# EAGLE design LB_BIT_1IN_3OUT-XL-v03(1_1x) (EAGLE 6.5.0)
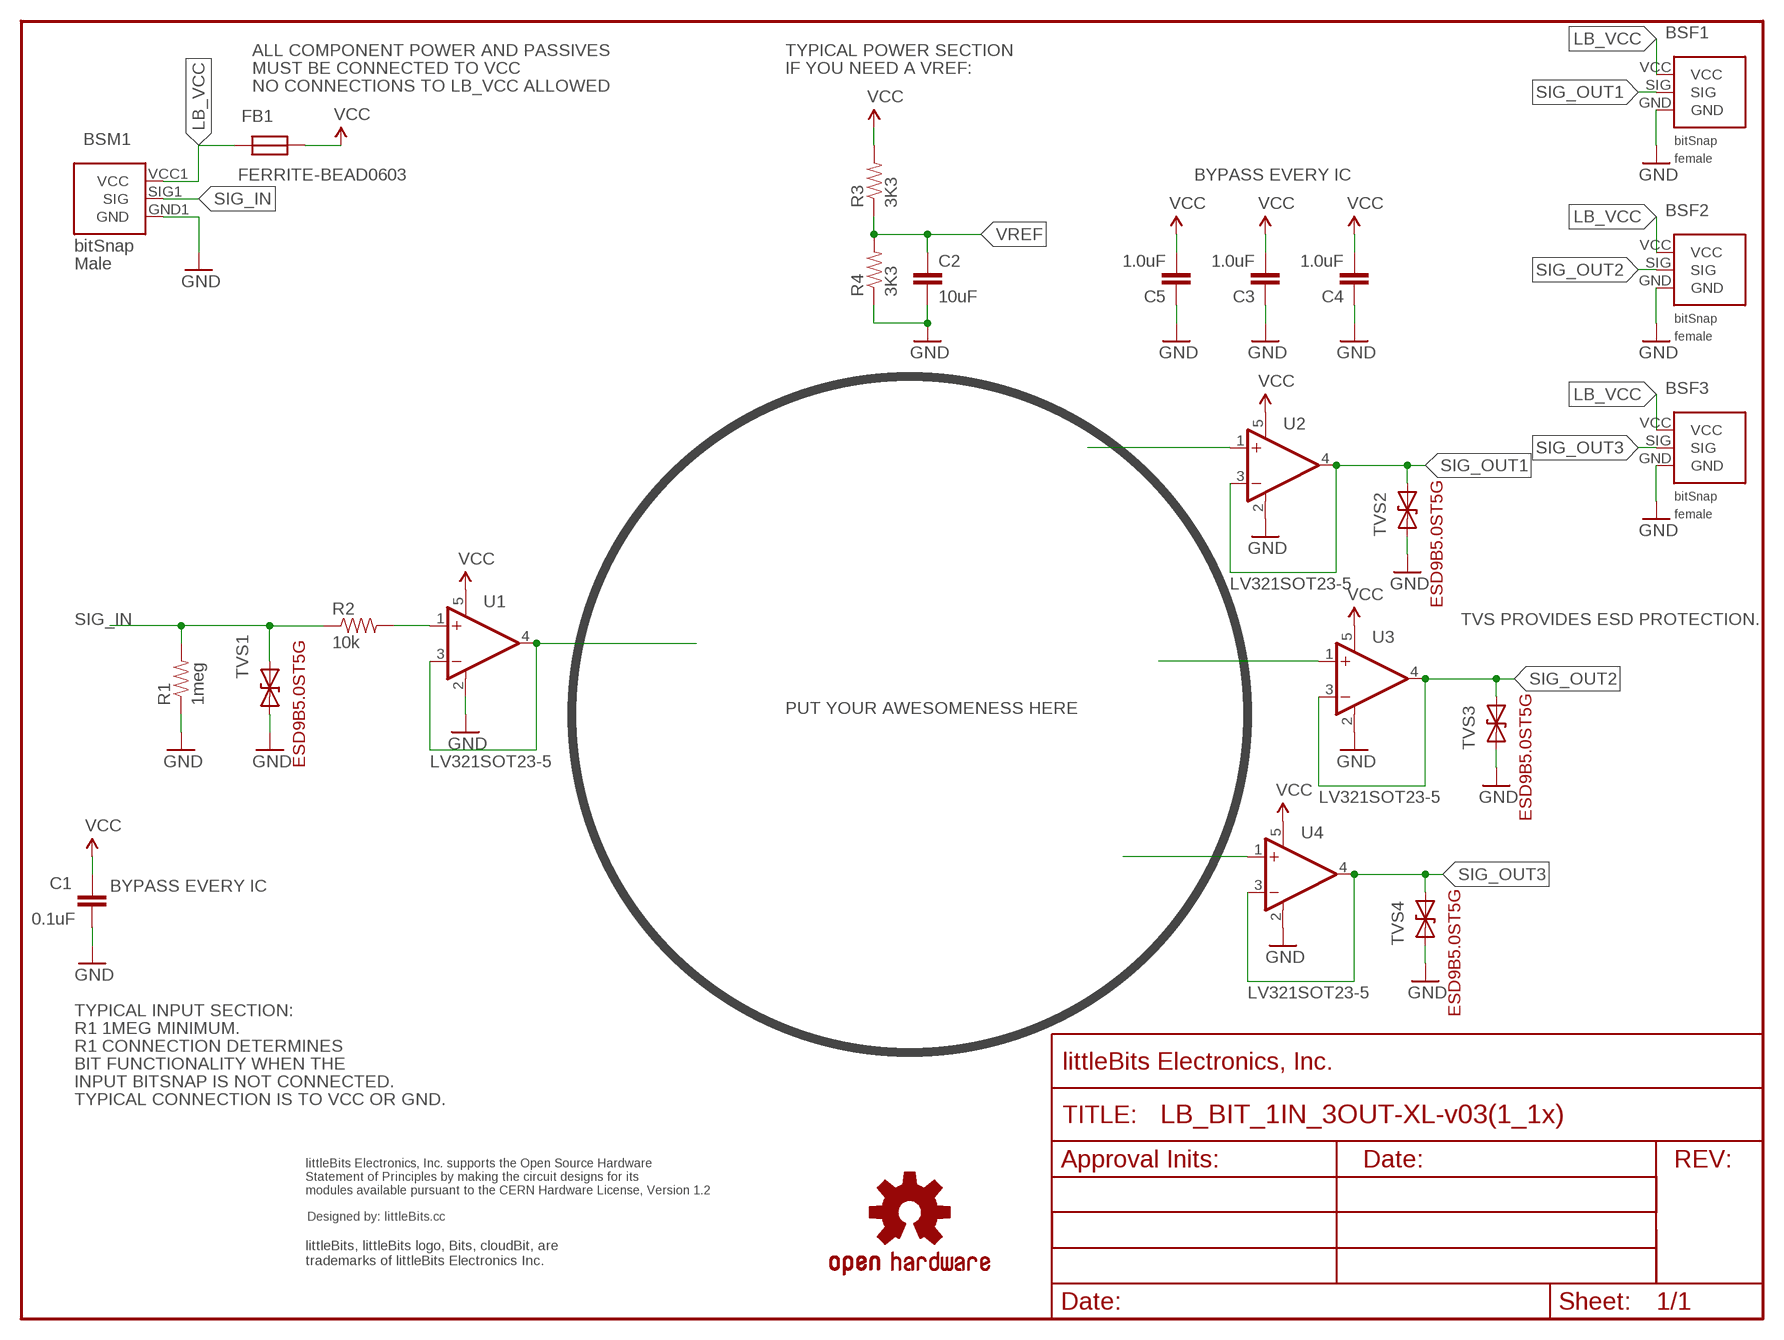
[diagram p0: schematic, sheet 1]

## Parts
BSF1  BITSNAP_V03_FEMALE  [BITSNAP_V03_FEMALE]
BSF2  BITSNAP_V03_FEMALE  [BITSNAP_V03_FEMALE]
BSF3  BITSNAP_V03_FEMALE  [BITSNAP_V03_FEMALE]
BSM1  BITSNAP_V03_MALE  [BITSNAP_V03_MALE]
C1  0.1uF  CAPCAP-0603  [CAP-0603]
C2  10uF  CAPCAP-0603  [CAP-0603]
C3  1.0uF  CAPCAP-0603  [CAP-0603]
C4  1.0uF  CAPCAP-0603  [CAP-0603]
C5  1.0uF  CAPCAP-0603  [CAP-0603]
FB1  FERRITE-BEAD0603  [R0603]
FRAME1  FRAME-LETTER  [FABDWG01-OHW]
R1  1meg  RESISTOR0603  [RES-0603]
R2  10k  RESISTOR0603  [RES-0603]
R3  3K3  RESISTOR0603  [RES-0603]
R4  3K3  RESISTOR0603  [RES-0603]
TVS1  DIODE-TVSSOD-923  [SOD-923]
TVS2  DIODE-TVSSOD-923  [SOD-923]
TVS3  DIODE-TVSSOD-923  [SOD-923]
TVS4  DIODE-TVSSOD-923  [SOD-923]
U1  LV321SOT23-5  [SOT23-5]
U2  LV321SOT23-5  [SOT23-5]
U3  LV321SOT23-5  [SOT23-5]
U4  LV321SOT23-5  [SOT23-5]
U$1  OSHWCREDIT  [OSHWCREDIT]
U$6  OSHW-LOGOL  [OSHW-LOGO-L]

## Nets
GND: BSF1.GND BSF2.GND BSF3.GND BSM1.GND1(GND) C1.2 C2.2 C3.1 C4.1 C5.1 R1.1 R4.1 TVS1.1(A) TVS2.1(A) TVS3.1(A) TVS4.1(A) U1.2(V-) U2.2(V-) U3.2(V-) U4.2(V-)
LB_VCC: BSF1.VCC BSF2.VCC BSF3.VCC BSM1.VCC1(VCC) FB1.2
N$1: U3.1(+IN)
N$2: U1.3(-IN) U1.4(OUT)
N$3: R2.2 U1.1(+IN)
N$4: U2.1(+IN)
N$5: U4.1(+IN)
SIG_IN: BSM1.SIG1(SIG) R1.2 R2.1 TVS1.2(C)
SIG_OUT1: BSF1.SIG TVS2.2(C) U2.3(-IN) U2.4(OUT)
SIG_OUT2: BSF2.SIG TVS3.2(C) U3.3(-IN) U3.4(OUT)
SIG_OUT3: BSF3.SIG TVS4.2(C) U4.3(-IN) U4.4(OUT)
VCC: C1.1 C3.2 C4.2 C5.2 FB1.1 R3.2 U1.5(V+) U2.5(V+) U3.5(V+) U4.5(V+)
VREF: C2.1 R3.1 R4.2

## Notes on the sheet
- ALL COMPONENT POWER AND PASSIVES | TYPICAL POWER SECTION
- MUST BE CONNECTED TO VCC | IF YOU NEED A VREF:
- NO CONNECTIONS TO LB_VCC ALLOWED
- BYPASS EVERY IC
- TVS PROVIDES ESD PROTECTION.
- PUT YOUR AWESOMENESS HERE
- BYPASS EVERY IC
- TYPICAL INPUT SECTION:
- R1 1MEG MINIMUM.
- R1 CONNECTION DETERMINES
- BIT FUNCTIONALITY WHEN THE
- INPUT BITSNAP IS NOT CONNECTED.
- TYPICAL CONNECTION IS TO VCC OR GND.

## Library data of the parts
BSF1-BSF3 = bitSnap:BITSNAP_V03_FEMALE
BSM1 = bitSnap:BITSNAP_V03_MALE
C1-C5 = LITTLEBITS:CAP
FB1 = LITTLEBITS:FERRITE-BEAD
FRAME1 = LITTLEBITS:FRAME-LETTER
R1-R4 = LITTLEBITS:RESISTOR
TVS1-TVS4 = LITTLEBITS:DIODE-TVS: Bidirectional Transient Voltage Suppression Diode: Device conducts in avalanche mode after reaching a part dependent voltage threshold. Used for limiting voltage spikes on ESD sensitive inputs and outputs.; IEC_ESD_PROT0: +/-18kV; LB_PN: ?; MPN: ESD9B5.0ST5G; V_CLAMP: ?; V_OPERATION: 5V
U1-U4 = LITTLEBITS:LV321
U$1 = LITTLEBITS:OSHWCREDIT
U$6 = SparkFun_NEW:OSHW-LOGO: Open Source Hardware Logo This logo indicates the piece of hardware it is found on incorporates a OSHW license and/or adheres to the definition of open source hardware found here: http://freedomdefined.org/OSHW

## Board
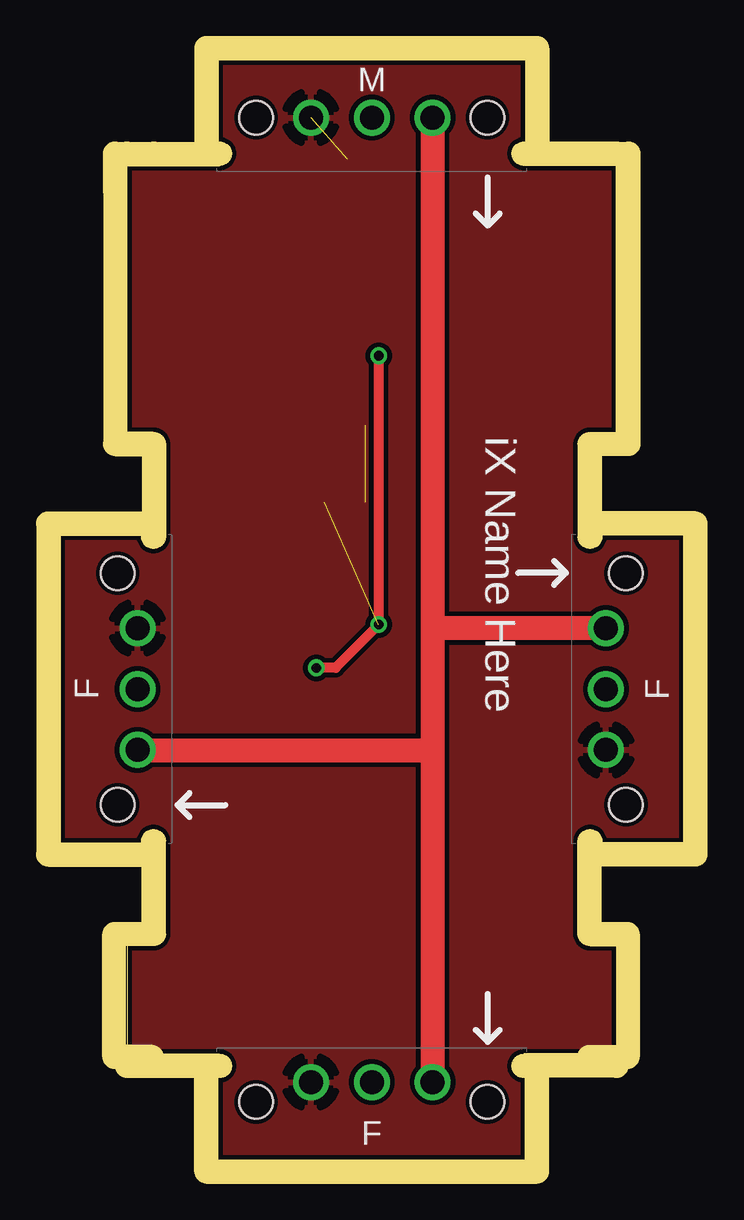
[diagram p1: board, top side]
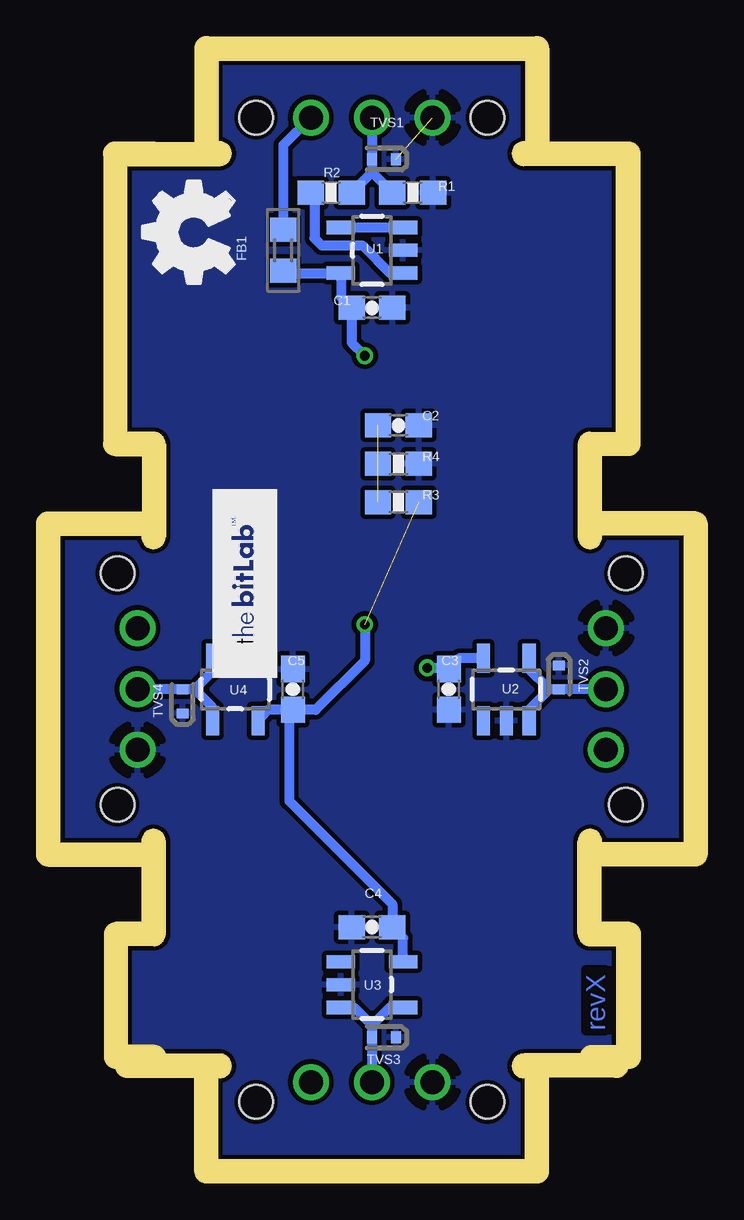
[diagram p2: board, bottom side, seen from below]

Size 26 x 45.81 mm. Coordinates in mm from the lower left corner, seen from the top.
Outline: 2.8,4.4 2.8,8.9 3.89,8.9 arc90 4.4,9.4
Outline: 23.2,4.4 23.2,8.9 22.1,8.9 arc-90 21.6,9.4
Outline: 23.2,41.41 23.2,30.31 22.1,30.31 arc90 21.6,29.8
Outline: 4.4,29.8 arc90 3.9,30.31 2.8,30.31 2.8,41.41
Copper layers (1*16): Top 0.035mm / dielectric 1.5mm / Bottom 0.035mm
Design rules "littleBitsDRC": minimum track width 0.2mm, minimum drill 0.4mm, track to track 0.2mm, track to pad 0.2mm, pad to pad 0.2mm, via to via 0.2mm, smd to smd 0mil, copper to edge 0.2mm, drill to drill 0.2mm, minimum pad ring 0.2mm, minimum via ring 0.15mm, stop-mask expansion 0.1mm, vias tented up to drill 0mil, thermal gap 0.2mm
Milling: 13 lines

### Footprints (pad centres in the part's own frame; a part is rotated, then mirrored left to right if it is on the bottom)
BITSNAP_V03_FEMALE = drill 1: GND 4.065,3.44; SIG 6.605,3.44; VCC 9.145,3.44 | hole 1.4: 1.785,2.61; 11.425,2.61
BITSNAP_V03_MALE = drill 1: GND1 9.145,2.61; SIG1 6.605,2.61; VCC1 4.065,2.61 | hole 1.4: 1.785,2.61; 11.425,2.61
CAP-0603 = smd 1.1 x 1: 1 -0.85,0; 2 0.85,0
R0603 = smd 1 x 1.1: 1 -0.85,0; 2 0.85,0
RES-0603 = smd 1.1 x 1: 1 -0.85,0; 2 0.85,0
SOD-923 = smd 0.4 x 0.5: 1 -0.5,0; 2 0.5,0
SOT23-5 = smd 0.55 x 1.2: 1 -0.95,-1.3; 2 0,-1.3; 3 0.95,-1.3; 4 0.95,1.3; 5 -0.95,1.3

### Placement (x,y rotation side)
BSF1  -0.21,26.21 270 top
BSF2  6.4,-0.21 0 top
BSF3  26.21,13 90 top
BSM1  19.61,46.02 180 top
C1  12.99,35.49 0 bottom
C2  11.89,30.59 0 bottom
C3  9.79,19.59 90 bottom
C4  12.99,9.69 0 bottom
C5  16.29,19.59 270 bottom
FB1  16.69,37.89 90 bottom
FRAME1  -0.21,-0.21 0 top
R1  11.29,40.29 180 bottom
R2  14.69,40.29 180 bottom
R3  11.89,27.39 0 bottom
R4  11.89,28.99 180 bottom
TVS1  12.49,41.69 180 bottom
TVS2  5.19,20.09 270 bottom
TVS3  12.49,5.09 180 bottom
TVS4  20.89,19.09 90 bottom
U1  12.99,37.89 90 bottom
U2  7.39,19.59 0 bottom
U3  12.99,7.29 270 bottom
U4  18.69,19.59 180 bottom
U$1  -92.58,-62.18 0 top  (outside the outline)
U$2  [BITLAB-LOGO]  16.95,27.92 270 top
U$5  [OSHW_FILLX150_NOTEXT]  18.74,35.68 0 top
U$6  -36.05,-69.38 0 top  (outside the outline)

### Tracks (layer width: path | path; a pad name or v marks a point on that pad's centre or on a via)
GND  (1 unrouted)
  pour Bottom: -0.21,46.09 26.09,46.09 26.19,-0.21 -0.21,-0.21
  pour Top: -0.21,46.09 26.09,46.09 26.19,-0.21 -0.21,-0.21
LB_VCC
  Top 1: BSM1.VCC1 15.54,21.99 | 15.54,21.99 15.54,17.09 | 15.54,17.09 BSF2.VCC | BSF3.VCC 15.69,22.14 15.54,21.99 | BSF1.VCC 15.51,17.06 15.54,17.09
  Bottom 0.406: BSM1.VCC1 16.69,42.27 FB1.2
N$2
  Bottom 0.406: U1.4 U1.3
N$3
  Bottom 0.406: R2.2 15.39,40.14 15.39,38.39 15.09,38.09 13.39,38.09 12.24,36.94 U1.1
SIG_IN
  Bottom 0.406: BSM1.SIG1 TVS1.2 12.99,41.14 | 12.99,41.14 R1.2 | R2.1 12.99,41.14
SIG_OUT1
  Bottom 0.406: BSF1.SIG 3.25,19.59 TVS2.2 5.59,19.59 | 5.59,19.59 6.44,20.44 U2.4 | 5.59,19.59 6.44,18.74 U2.3
SIG_OUT2
  Bottom 0.406: U3.4 12.24,6.34 12.99,5.59 | 12.99,5.59 TVS3.2 BSF2.SIG | U3.3 13.74,6.34 12.99,5.59
SIG_OUT3
  Bottom 0.406: U4.4 19.64,18.84 20.39,19.59 | 20.39,19.59 TVS4.2 22.75,19.59 BSF3.SIG | U4.3 19.64,20.34 20.39,19.59
VCC  (via drill 0.4)  (1 unrouted)
  Top 0.406: v13.29,33.49 v13.29,22.29 11.49,20.49 v10.69,20.49
  Bottom 0.406: FB1.1 16.59,36.94 U1.5 14.29,35.94 C1.1 13.84,34.04 v13.29,33.49 | U3.5 11.69,9.24 C4.2 12.14,10.64 16.44,14.94 16.44,18.59 C5.2 | U2.5 9.34,20.89 C3.2 9.84,20.49 v10.69,20.49 | v13.29,22.29 13.29,20.79 15.34,18.74 C5.2 | C5.2 17.34,18.74 17.39,18.69 U4.5
VREF  (2 unrouted)

### Text on the board
Bottom: revX
tPlace: iX Name Here
Milling: 1mm DIA. ROUTER PATH